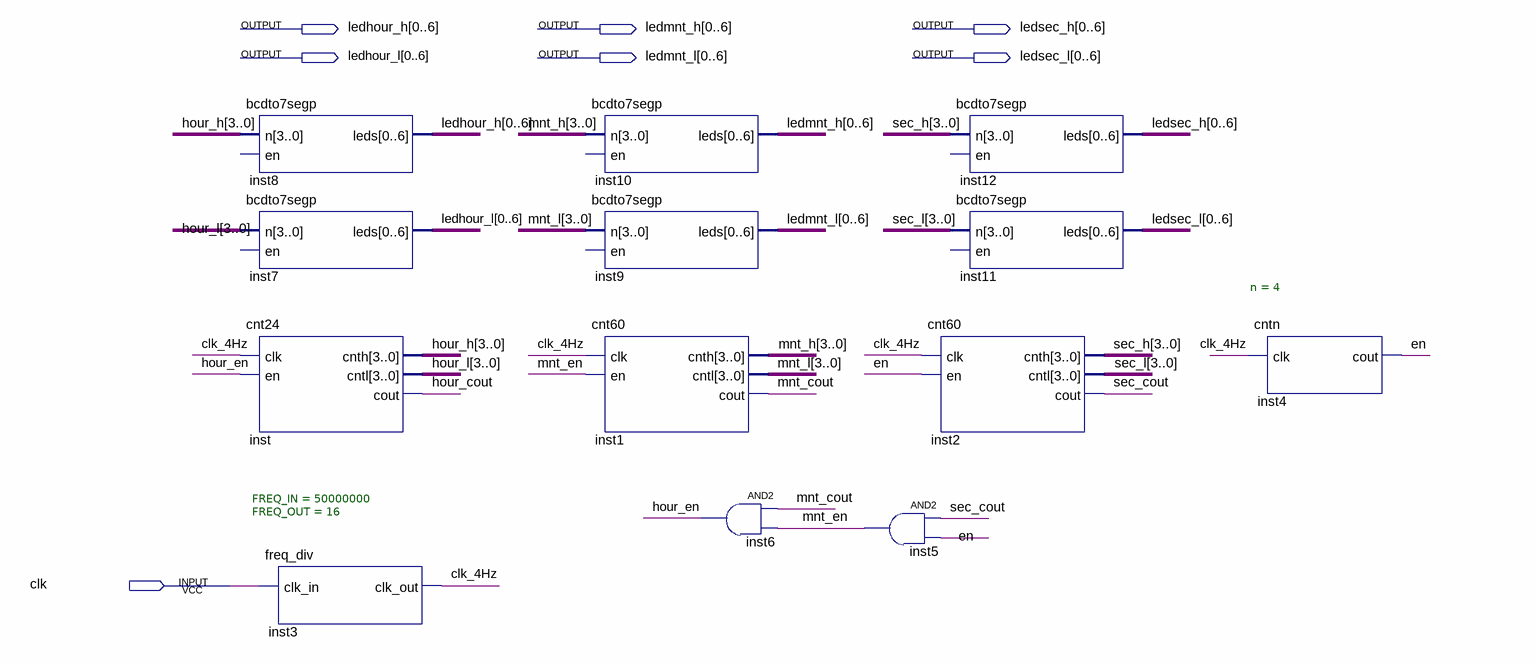
[diagram p0: schematic sheet]
// Quartus schematic DigitalClock1.bdf as structural Verilog: 13 symbols, 7 pins
module DigitalClock1 (
  input  clk,
  output [0:6] ledhour_h,
  output [0:6] ledmnt_h,
  output [0:6] ledsec_h,
  output [0:6] ledhour_l,
  output [0:6] ledmnt_l,
  output [0:6] ledsec_l
);

  wire clk_4Hz, en, hour_cout, hour_en, mnt_cout, mnt_en, sec_cout;
  wire [3:0] hour_h, hour_l, mnt_h, mnt_l, sec_h, sec_l;

  bcdto7segp inst8 (.n(hour_h), .leds(ledhour_h));  // open: en
  bcdto7segp inst7 (.n(hour_l), .leds(ledhour_l));  // open: en
  cnt24 inst (.clk(clk_4Hz), .en(hour_en), .cnth(hour_h), .cntl(hour_l), .cout(hour_cout));
  freq_div #(.FREQ_IN(50000000), .FREQ_OUT(16)) inst3 (.clk_in(clk), .clk_out(clk_4Hz));
  bcdto7segp inst10 (.n(mnt_h), .leds(ledmnt_h));  // open: en
  bcdto7segp inst9 (.n(mnt_l), .leds(ledmnt_l));  // open: en
  cnt60 inst1 (.clk(clk_4Hz), .en(mnt_en), .cnth(mnt_h), .cntl(mnt_l), .cout(mnt_cout));
  and inst6 (hour_en, mnt_cout, mnt_en);
  and inst5 (mnt_en, sec_cout, en);
  bcdto7segp inst12 (.n(sec_h), .leds(ledsec_h));  // open: en
  bcdto7segp inst11 (.n(sec_l), .leds(ledsec_l));  // open: en
  cnt60 inst2 (.clk(clk_4Hz), .en(en), .cnth(sec_h), .cntl(sec_l), .cout(sec_cout));
  cntn #(.n(4)) inst4 (.clk(clk_4Hz), .cout(en));
endmodule
